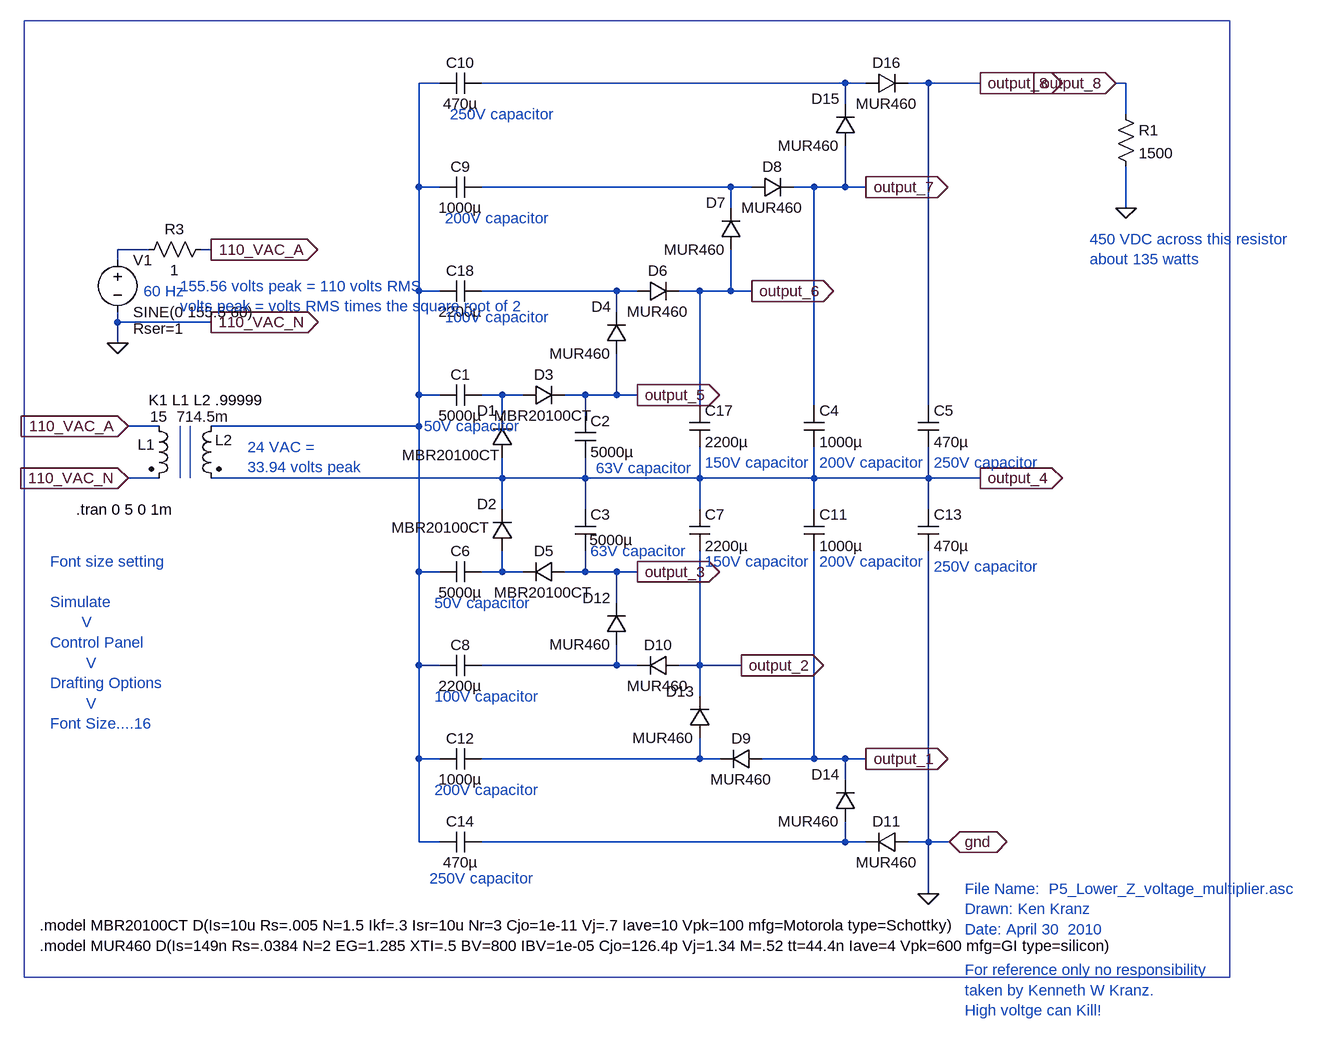
[diagram p0: schematic P5_Lower_z_voltage_multiplier.asc]
P5_Lower_z_voltage_multiplier.asc, the LTspice schematic file:
Version 4
SHEET 1 2468 1348
WIRE 192 -32 160 -32
WIRE 816 -32 256 -32
WIRE 848 -32 816 -32
WIRE 944 -32 912 -32
WIRE 1024 -32 944 -32
WIRE 1248 -32 1232 -32
WIRE 816 0 816 -32
WIRE 1248 16 1248 -32
WIRE 160 128 160 -32
WIRE 192 128 160 128
WIRE 640 128 256 128
WIRE 672 128 640 128
WIRE 768 128 736 128
WIRE 816 128 816 64
WIRE 816 128 768 128
WIRE 848 128 816 128
WIRE 640 160 640 128
WIRE 1248 160 1248 96
WIRE -256 224 -304 224
WIRE -160 224 -176 224
WIRE -304 240 -304 224
WIRE 160 288 160 128
WIRE 192 288 160 288
WIRE 464 288 256 288
WIRE 496 288 464 288
WIRE 592 288 560 288
WIRE 640 288 640 224
WIRE 640 288 592 288
WIRE 672 288 640 288
WIRE 464 320 464 288
WIRE -304 336 -304 320
WIRE -160 336 -304 336
WIRE -304 368 -304 336
WIRE 160 448 160 288
WIRE 192 448 160 448
WIRE 288 448 256 448
WIRE 320 448 288 448
WIRE 416 448 384 448
WIRE 464 448 464 384
WIRE 464 448 416 448
WIRE 496 448 464 448
WIRE 592 464 592 288
WIRE 768 464 768 128
WIRE 944 464 944 -32
WIRE 288 480 288 448
WIRE 416 480 416 448
WIRE -240 496 -288 496
WIRE 160 496 160 448
WIRE 160 496 -160 496
WIRE -240 576 -288 576
WIRE 288 576 288 544
WIRE 288 576 -160 576
WIRE 416 576 416 544
WIRE 416 576 288 576
WIRE 592 576 592 528
WIRE 592 576 416 576
WIRE 768 576 768 528
WIRE 768 576 592 576
WIRE 944 576 944 528
WIRE 944 576 768 576
WIRE 1024 576 944 576
WIRE 288 624 288 576
WIRE 416 624 416 576
WIRE 592 624 592 576
WIRE 768 624 768 576
WIRE 944 624 944 576
WIRE 160 720 160 496
WIRE 192 720 160 720
WIRE 288 720 288 688
WIRE 288 720 256 720
WIRE 320 720 288 720
WIRE 416 720 416 688
WIRE 416 720 384 720
WIRE 464 720 416 720
WIRE 496 720 464 720
WIRE 464 768 464 720
WIRE 160 864 160 720
WIRE 192 864 160 864
WIRE 464 864 464 832
WIRE 464 864 256 864
WIRE 496 864 464 864
WIRE 592 864 592 688
WIRE 592 864 560 864
WIRE 656 864 592 864
WIRE 592 912 592 864
WIRE 160 1008 160 864
WIRE 192 1008 160 1008
WIRE 592 1008 592 976
WIRE 592 1008 256 1008
WIRE 624 1008 592 1008
WIRE 768 1008 768 688
WIRE 768 1008 688 1008
WIRE 816 1008 768 1008
WIRE 848 1008 816 1008
WIRE 816 1040 816 1008
WIRE 160 1136 160 1008
WIRE 192 1136 160 1136
WIRE 816 1136 816 1104
WIRE 816 1136 256 1136
WIRE 848 1136 816 1136
WIRE 944 1136 944 688
WIRE 944 1136 912 1136
WIRE 976 1136 944 1136
WIRE 944 1216 944 1136
FLAG -288 496 110_VAC_A
IOPIN -288 496 In
FLAG -288 576 110_VAC_N
IOPIN -288 576 In
FLAG -304 368 0
FLAG -160 224 110_VAC_A
IOPIN -160 224 Out
FLAG -160 336 110_VAC_N
IOPIN -160 336 Out
FLAG 848 1008 output_1
IOPIN 848 1008 Out
FLAG 656 864 output_2
IOPIN 656 864 Out
FLAG 496 720 output_3
IOPIN 496 720 Out
FLAG 496 448 output_5
IOPIN 496 448 Out
FLAG 944 1216 0
FLAG 672 288 output_6
IOPIN 672 288 Out
FLAG 848 128 output_7
IOPIN 848 128 Out
FLAG 1024 -32 output_8
IOPIN 1024 -32 Out
FLAG 1024 576 output_4
IOPIN 1024 576 Out
FLAG 976 1136 gnd
IOPIN 976 1136 BiDir
FLAG 1248 160 0
FLAG 1232 -32 output_8
IOPIN 1232 -32 In
SYMBOL ind2 -256 480 R0
WINDOW 0 -17 44 Left 0
WINDOW 3 2 1 Left 0
SYMATTR InstName L1
SYMATTR Value 15
SYMATTR Type ind
SYMATTR SpiceLine Rser=0
SYMBOL ind2 -144 480 M0
WINDOW 0 -17 37 Left 0
WINDOW 3 -12 1 Left 0
SYMATTR InstName L2
SYMATTR Value 714.5m
SYMATTR Type ind
SYMATTR SpiceLine Rser=1m
SYMBOL voltage -304 224 R0
WINDOW 123 0 0 Left 0
WINDOW 39 24 122 Left 0
SYMATTR SpiceLine Rser=1
SYMATTR InstName V1
SYMATTR Value SINE(0 155.5 60)
SYMBOL res -160 208 R90
WINDOW 0 0 56 VBottom 0
WINDOW 3 32 56 VTop 0
SYMATTR InstName R3
SYMATTR Value 1
SYMBOL cap 400 480 R0
SYMATTR InstName C2
SYMATTR Value 5000µ
SYMBOL cap 256 432 R90
WINDOW 0 0 32 VBottom 0
WINDOW 3 32 32 VTop 0
SYMATTR InstName C1
SYMATTR Value 5000µ
SYMBOL cap 576 464 R0
SYMATTR InstName C17
SYMATTR Value 2200µ
SYMBOL cap 256 272 R90
WINDOW 0 0 32 VBottom 0
WINDOW 3 32 32 VTop 0
SYMATTR InstName C18
SYMATTR Value 2200µ
SYMBOL cap 752 464 R0
SYMATTR InstName C4
SYMATTR Value 1000µ
SYMBOL cap 928 464 R0
SYMATTR InstName C5
SYMATTR Value 470µ
SYMBOL cap 256 112 R90
WINDOW 0 0 32 VBottom 0
WINDOW 3 32 32 VTop 0
SYMATTR InstName C9
SYMATTR Value 1000µ
SYMBOL cap 256 -48 R90
WINDOW 0 0 32 VBottom 0
WINDOW 3 32 32 VTop 0
SYMATTR InstName C10
SYMATTR Value 470µ
SYMBOL diode 304 688 R180
WINDOW 0 24 72 Left 0
WINDOW 3 33 36 Left 0
SYMATTR InstName D2
SYMATTR Value MBR20100CT
SYMBOL cap 400 624 R0
WINDOW 3 22 47 Left 0
SYMATTR Value 5000µ
SYMATTR InstName C3
SYMBOL cap 256 704 R90
WINDOW 0 0 32 VBottom 0
WINDOW 3 32 32 VTop 0
SYMATTR InstName C6
SYMATTR Value 5000µ
SYMBOL diode 560 848 R90
WINDOW 0 0 32 VBottom 0
WINDOW 3 32 32 VTop 0
SYMATTR InstName D10
SYMATTR Value MUR460
SYMBOL cap 576 624 R0
SYMATTR InstName C7
SYMATTR Value 2200µ
SYMBOL cap 256 848 R90
WINDOW 0 0 32 VBottom 0
WINDOW 3 32 32 VTop 0
SYMATTR InstName C8
SYMATTR Value 2200µ
SYMBOL cap 752 624 R0
SYMATTR InstName C11
SYMATTR Value 1000µ
SYMBOL cap 256 992 R90
WINDOW 0 0 32 VBottom 0
WINDOW 3 32 32 VTop 0
SYMATTR InstName C12
SYMATTR Value 1000µ
SYMBOL cap 928 624 R0
SYMATTR InstName C13
SYMATTR Value 470µ
SYMBOL cap 256 1120 R90
WINDOW 0 0 32 VBottom 0
WINDOW 3 32 32 VTop 0
SYMATTR InstName C14
SYMATTR Value 470µ
SYMBOL res 1232 0 R0
SYMATTR InstName R1
SYMATTR Value 1500
SYMBOL diode 304 544 R180
WINDOW 0 24 72 Left 0
WINDOW 3 17 4 Left 0
SYMATTR InstName D1
SYMATTR Value MBR20100CT
SYMBOL diode 320 464 R270
WINDOW 0 32 32 VTop 0
WINDOW 3 0 32 VBottom 0
SYMATTR InstName D3
SYMATTR Value MBR20100CT
SYMBOL diode 384 704 R90
WINDOW 0 0 32 VBottom 0
WINDOW 3 32 32 VTop 0
SYMATTR InstName D5
SYMATTR Value MBR20100CT
SYMBOL diode 688 992 R90
WINDOW 0 0 32 VBottom 0
WINDOW 3 32 32 VTop 0
SYMATTR InstName D9
SYMATTR Value MUR460
SYMBOL diode 912 1120 R90
WINDOW 0 0 32 VBottom 0
WINDOW 3 32 32 VTop 0
SYMATTR InstName D11
SYMATTR Value MUR460
SYMBOL diode 480 832 R180
WINDOW 0 24 72 Left 0
WINDOW 3 24 0 Left 0
SYMATTR InstName D12
SYMATTR Value MUR460
SYMBOL diode 608 976 R180
WINDOW 0 24 72 Left 0
WINDOW 3 24 0 Left 0
SYMATTR InstName D13
SYMATTR Value MUR460
SYMBOL diode 832 1104 R180
WINDOW 0 24 72 Left 0
WINDOW 3 24 0 Left 0
SYMATTR InstName D14
SYMATTR Value MUR460
SYMBOL diode 480 384 R180
WINDOW 0 24 72 Left 0
WINDOW 3 24 0 Left 0
SYMATTR InstName D4
SYMATTR Value MUR460
SYMBOL diode 656 224 R180
WINDOW 0 24 72 Left 0
WINDOW 3 24 0 Left 0
SYMATTR InstName D7
SYMATTR Value MUR460
SYMBOL diode 832 64 R180
WINDOW 0 24 72 Left 0
WINDOW 3 24 0 Left 0
SYMATTR InstName D15
SYMATTR Value MUR460
SYMBOL diode 496 304 R270
WINDOW 0 32 32 VTop 0
WINDOW 3 0 32 VBottom 0
SYMATTR InstName D6
SYMATTR Value MUR460
SYMBOL diode 672 144 R270
WINDOW 0 32 32 VTop 0
WINDOW 3 0 32 VBottom 0
SYMATTR InstName D8
SYMATTR Value MUR460
SYMBOL diode 848 -16 R270
WINDOW 0 32 32 VTop 0
WINDOW 3 0 32 VBottom 0
SYMATTR InstName D16
SYMATTR Value MUR460
TEXT -368 624 Left 0 !.tran 0 5 0 1m
TEXT -256 456 Left 0 !K1 L1 L2 .99999
TEXT -208 280 Left 0 ;155.56 volts peak = 110 volts RMS\nvolts peak = volts RMS times the square root of 2
TEXT -264 288 Left 0 ;60 Hz
TEXT -408 704 Left 0 ;Font size setting\n \nSimulate\n       V\nControl Panel\n        V\nDrafting Options\n        V\nFont Size....16
TEXT -104 528 Left 0 ;24 VAC = \n33.94 volts peak
TEXT 432 560 Left 0 ;63V capacitor
TEXT 168 496 Left 0 ;50V capacitor
TEXT 600 552 Left 0 ;150V capacitor
TEXT 200 328 Left 0 ;100V capacitor
TEXT 200 176 Left 0 ;200V capacitor
TEXT 776 552 Left 0 ;200V capacitor
TEXT 208 16 Left 0 ;250V capacitor
TEXT 952 552 Left 0 ;250V capacitor
TEXT 184 768 Left 0 ;50V capacitor
TEXT 424 688 Left 0 ;63V capacitor
TEXT 184 912 Left 0 ;100V capacitor
TEXT 184 1056 Left 0 ;200V capacitor
TEXT 176 1192 Left 0 ;250V capacitor
TEXT 600 704 Left 0 ;150V capacitor
TEXT 776 704 Left 0 ;200V capacitor
TEXT 952 712 Left 0 ;250V capacitor
TEXT 1192 208 Left 0 ;450 VDC across this resistor\nabout 135 watts
TEXT -424 1264 Left 0 !.model MBR20100CT D(Is=10u Rs=.005 N=1.5 Ikf=.3 Isr=10u Nr=3 Cjo=1e-11 Vj=.7 Iave=10 Vpk=100 mfg=Motorola type=Schottky)
TEXT -424 1296 Left 0 !.model MUR460 D(Is=149n Rs=.0384 N=2 EG=1.285 XTI=.5 BV=800 IBV=1e-05 Cjo=126.4p Vj=1.34 M=.52 tt=44.4n Iave=4 Vpk=600 mfg=GI type=silicon)
TEXT 1000 1208 Left 0 ;File Name:  P5_Lower_Z_voltage_multiplier.asc\nDrawn: Ken Kranz\nDate: April 30  2010\n \nFor reference only no responsibility\ntaken by Kenneth W Kranz.\nHigh voltge can Kill!
LINE Normal -208 576 -208 496
LINE Normal -192 576 -192 496
RECTANGLE Normal 1408 1344 -448 -128

The netlist it stands for:
* P5_Lower_z_voltage_multiplier.asc
L1 110_VAC_A 0 15 Rser=0
L2 N001 output_4 714.5m Rser=1m
V1 N004 0 SINE(0 155.5 60) Rser=1
R3 110_VAC_A N004 1
C2 output_5 output_4 5000µ
C1 N006 N001 5000µ
C17 output_6 output_4 2200µ
C18 N005 N001 2200µ
C4 output_7 output_4 1000µ
C5 output_8 output_4 470µ
C9 N003 N001 1000µ
C10 N002 N001 470µ
D2 N007 output_4 MBR20100CT
C3 output_4 output_3 5000µ
C6 N007 N001 5000µ
D10 output_2 N008 MUR460
C7 output_4 output_2 2200µ
C8 N008 N001 2200µ
C11 output_4 output_1 1000µ
C12 N009 N001 1000µ
C13 output_4 0 470µ
C14 N010 N001 470µ
R1 output_8 0 1500
D1 output_4 N006 MBR20100CT
D3 N006 output_5 MBR20100CT
D5 output_3 N007 MBR20100CT
D9 output_1 N009 MUR460
D11 0 N010 MUR460
D12 N008 output_3 MUR460
D13 N009 output_2 MUR460
D14 N010 output_1 MUR460
D4 output_5 N005 MUR460
D7 output_6 N003 MUR460
D15 output_7 N002 MUR460
D6 N005 output_6 MUR460
D8 N003 output_7 MUR460
D16 N002 output_8 MUR460
.model D D
.lib standard.dio
.tran 0 5 0 1m
K1 L1 L2 .99999
* 155.56 volts peak = 110 volts RMS
* volts peak = volts RMS times the square root of 2
* 60 Hz
* Font size setting
* Simulate
*        V
* Control Panel
*         V
* Drafting Options
*         V
* Font Size....16
* 24 VAC =
* 33.94 volts peak
* 63V capacitor
* 50V capacitor
* 150V capacitor
* 100V capacitor
* 200V capacitor
* 200V capacitor
* 250V capacitor
* 250V capacitor
* 50V capacitor
* 63V capacitor
* 100V capacitor
* 200V capacitor
* 250V capacitor
* 150V capacitor
* 200V capacitor
* 250V capacitor
* 450 VDC across this resistor
* about 135 watts
.model MBR20100CT D(Is=10u Rs=.005 N=1.5 Ikf=.3 Isr=10u Nr=3 Cjo=1e-11 Vj=.7 Iave=10 Vpk=100 mfg=Motorola type=Schottky)
.model MUR460 D(Is=149n Rs=.0384 N=2 EG=1.285 XTI=.5 BV=800 IBV=1e-05 Cjo=126.4p Vj=1.34 M=.52 tt=44.4n Iave=4 Vpk=600 mfg=GI type=silicon)
* File Name:  P5_Lower_Z_voltage_multiplier.asc
* Drawn: Ken Kranz
* Date: April 30  2010
* For reference only no responsibility
* taken by Kenneth W Kranz.
* High voltge can Kill!
.backanno
.end